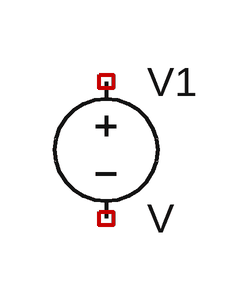
[diagram p0: schematic lab1.asc]
lab1.asc, the LTspice schematic file:
Version 4
SHEET 1 880 680
SYMBOL voltage 32 80 R0
SYMATTR InstName V1

The netlist it stands for:
* lab1.asc
V1 NC_01 NC_02 V
.backanno
.end